# Altium schematic sheet Power_Enable.SchDoc
size A4
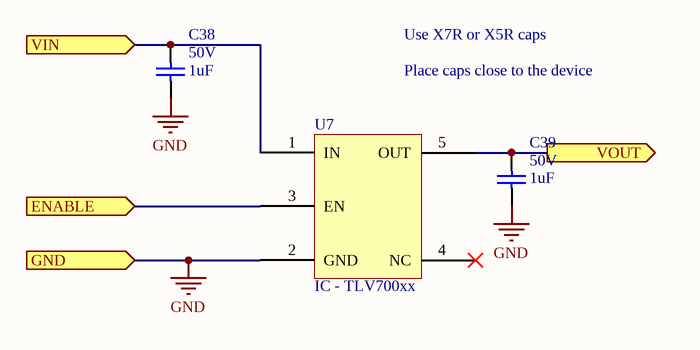
[diagram p0: Power_Enable.SchDoc]

## Parts
C38  value 1uF  VOLTAGE: 50V  [CS-0603]  (hidden comment: CS - CAPACITOR)
C39  value 1uF  VOLTAGE: 50V  [CS-0603]  (hidden comment: CS - CAPACITOR)
U7  IC - TLV700xx  [IC-SOT-23-5]

## Ports
ENABLE (in), GND (in), VIN (in), VOUT (out)

## Nets
GND: C38.1 C39.1 U7.2(GND) ; port GND
ENABLE: U7.3(EN) ; port ENABLE
VIN: C38.2 U7.1(IN) ; port VIN
VOUT: C39.2 U7.5(OUT) ; port VOUT

Not connected (* = marked no-connect by the designer): U7 4(NC)*

## Notes on the sheet
- Use X7R or X5R caps
- Place caps close to the device

## Library data of the parts
C38 C39 = CS - CAPACITOR: TOLERANCE: 10%; Supplier 1: *; Supplier Part Number 1: *; (FIELD A): *; (FLIED C): *; (FIELD B): *; Manufacturer: *
U7 = IC - TLV700xx: LDO